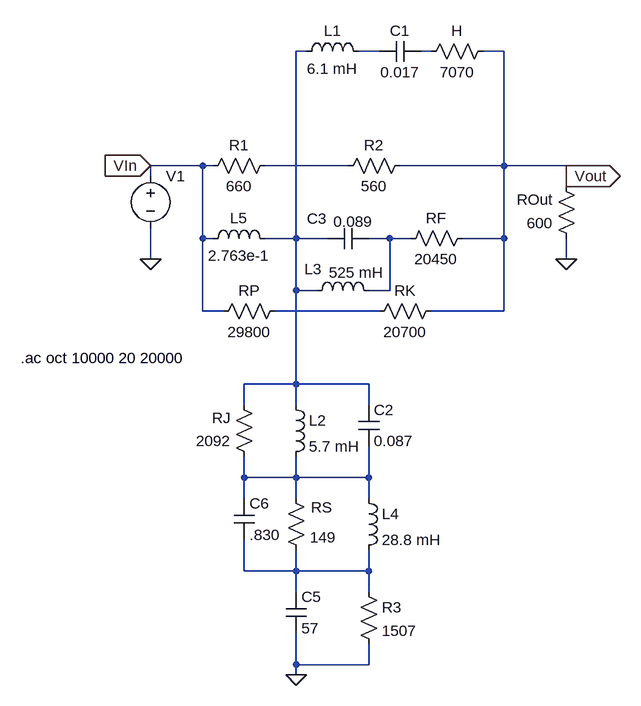
[diagram p0: schematic simplified_circuit.asc]
simplified_circuit.asc, the LTspice schematic file:
Version 4
SHEET 1 880 1040
WIRE 224 64 208 64
WIRE 336 64 304 64
WIRE 416 64 400 64
WIRE 528 64 496 64
WIRE 64 240 -16 240
WIRE 80 240 64 240
WIRE 288 240 160 240
WIRE 528 240 528 64
WIRE 528 240 368 240
WIRE 624 240 528 240
WIRE -16 256 -16 240
WIRE 624 256 624 240
WIRE 624 272 624 256
WIRE 64 352 64 240
WIRE 80 352 64 352
WIRE 208 352 208 64
WIRE 208 352 160 352
WIRE 256 352 208 352
WIRE 352 352 320 352
WIRE 384 352 352 352
WIRE 528 352 528 240
WIRE 528 352 464 352
WIRE -16 384 -16 336
WIRE 624 384 624 352
WIRE 208 432 208 352
WIRE 240 432 208 432
WIRE 352 432 352 352
WIRE 352 432 320 432
WIRE 64 464 64 352
WIRE 96 464 64 464
WIRE 336 464 176 464
WIRE 528 464 528 352
WIRE 528 464 416 464
WIRE 208 576 208 432
WIRE 208 576 128 576
WIRE 320 576 208 576
WIRE 128 608 128 576
WIRE 208 608 208 576
WIRE 320 608 320 576
WIRE 128 720 128 688
WIRE 208 720 208 688
WIRE 208 720 128 720
WIRE 320 720 320 672
WIRE 320 720 208 720
WIRE 128 752 128 720
WIRE 208 752 208 720
WIRE 320 752 320 720
WIRE 128 864 128 816
WIRE 208 864 208 832
WIRE 208 864 128 864
WIRE 320 864 320 832
WIRE 320 864 208 864
WIRE 208 896 208 864
WIRE 320 896 320 864
WIRE 208 1008 208 960
WIRE 320 1008 320 976
WIRE 320 1008 208 1008
WIRE 208 1024 208 1008
FLAG 208 1024 0
FLAG 624 384 0
FLAG -16 384 0
FLAG -16 240 VIn
IOPIN -16 240 In
FLAG 624 256 Vout
IOPIN 624 256 Out
SYMBOL res 384 224 R90
WINDOW 0 0 56 VBottom 2
WINDOW 3 32 56 VTop 2
SYMATTR InstName R2
SYMATTR Value 560
SYMBOL res 512 48 R90
WINDOW 0 0 56 VBottom 2
WINDOW 3 32 56 VTop 2
SYMATTR InstName H
SYMATTR Value 7070
SYMBOL res 480 336 R90
WINDOW 0 0 56 VBottom 2
WINDOW 3 32 56 VTop 2
SYMATTR InstName RF
SYMATTR Value 20450
SYMBOL res 176 224 R90
WINDOW 0 0 56 VBottom 2
WINDOW 3 32 56 VTop 2
SYMATTR InstName R1
SYMATTR Value 660
SYMBOL res 144 704 R180
WINDOW 0 36 76 Left 2
WINDOW 3 36 40 Left 2
SYMATTR InstName RJ
SYMATTR Value 2092
SYMBOL res 224 848 R180
WINDOW 0 -40 82 Left 2
WINDOW 3 -46 36 Left 2
SYMATTR InstName RS
SYMATTR Value 149
SYMBOL res 640 368 R180
WINDOW 0 36 76 Left 2
WINDOW 3 36 40 Left 2
SYMATTR InstName ROut
SYMATTR Value 600
SYMBOL ind 224 448 R270
WINDOW 0 33 10 VTop 2
WINDOW 3 59 77 VBottom 2
SYMATTR InstName L3
SYMATTR Value 525 mH
SYMBOL Ind 208 80 R270
WINDOW 0 32 56 VTop 2
WINDOW 3 5 56 VBottom 2
SYMATTR InstName L1
SYMATTR Value 6.1 mH
SYMBOL Ind 64 368 R270
WINDOW 0 32 56 VTop 2
WINDOW 3 5 56 VBottom 2
SYMATTR InstName L5
SYMATTR Value 2.763e-1
SYMBOL ind 192 592 R0
SYMATTR InstName L2
SYMATTR Value 5.7 mH
SYMBOL Ind 304 736 R0
SYMATTR InstName L4
SYMATTR Value 28.8 mH
SYMBOL Cap 112 752 R0
SYMATTR InstName C6
SYMATTR Value .830
SYMBOL Cap 304 608 R0
SYMATTR InstName C2
SYMATTR Value 0.087
SYMBOL Cap 320 336 R90
WINDOW 0 1 80 VBottom 2
WINDOW 3 -26 24 VTop 2
SYMATTR InstName C3
SYMATTR Value 0.089
SYMBOL Cap 400 48 R90
WINDOW 0 0 32 VBottom 2
WINDOW 3 32 32 VTop 2
SYMATTR InstName C1
SYMATTR Value 0.017
SYMBOL Voltage -16 240 R0
SYMATTR InstName V1
SYMATTR Value ""
SYMATTR Value2 AC 1
SYMBOL Res 192 448 R90
WINDOW 0 0 56 VBottom 2
WINDOW 3 32 56 VTop 2
SYMATTR InstName RP
SYMATTR Value 29800
SYMBOL Res 432 448 R90
WINDOW 0 0 56 VBottom 2
WINDOW 3 32 56 VTop 2
SYMATTR InstName RK
SYMATTR Value 20700
SYMBOL Cap 192 896 R0
SYMATTR InstName C5
SYMATTR Value 57
SYMBOL Res 304 880 R0
SYMATTR InstName R3
SYMATTR Value 1507
TEXT -216 536 Left 2 !.ac oct 10000 20 20000

The netlist it stands for:
* simplified_circuit.asc
R2 Vout N004 560
R§H Vout N003 7070
RF Vout N005 20450
R1 N004 VIn 660
RJ N007 N001 2092
RS N008 N007 149
ROut 0 Vout 600
L3 N001 N005 525 mH
L1 N001 N002 6.1 mH
L5 VIn N001 2.763e-1
L2 N001 N007 5.7 mH
L4 N007 N008 28.8 mH
C6 N007 N008 .830
C2 N001 N007 0.087
C3 N005 N001 0.089
C1 N003 N002 0.017
V1 VIn 0 AC 1
RP N006 VIn 29800
RK Vout N006 20700
C5 N008 0 57
R3 N008 0 1507
.ac oct 10000 20 20000
.backanno
.end